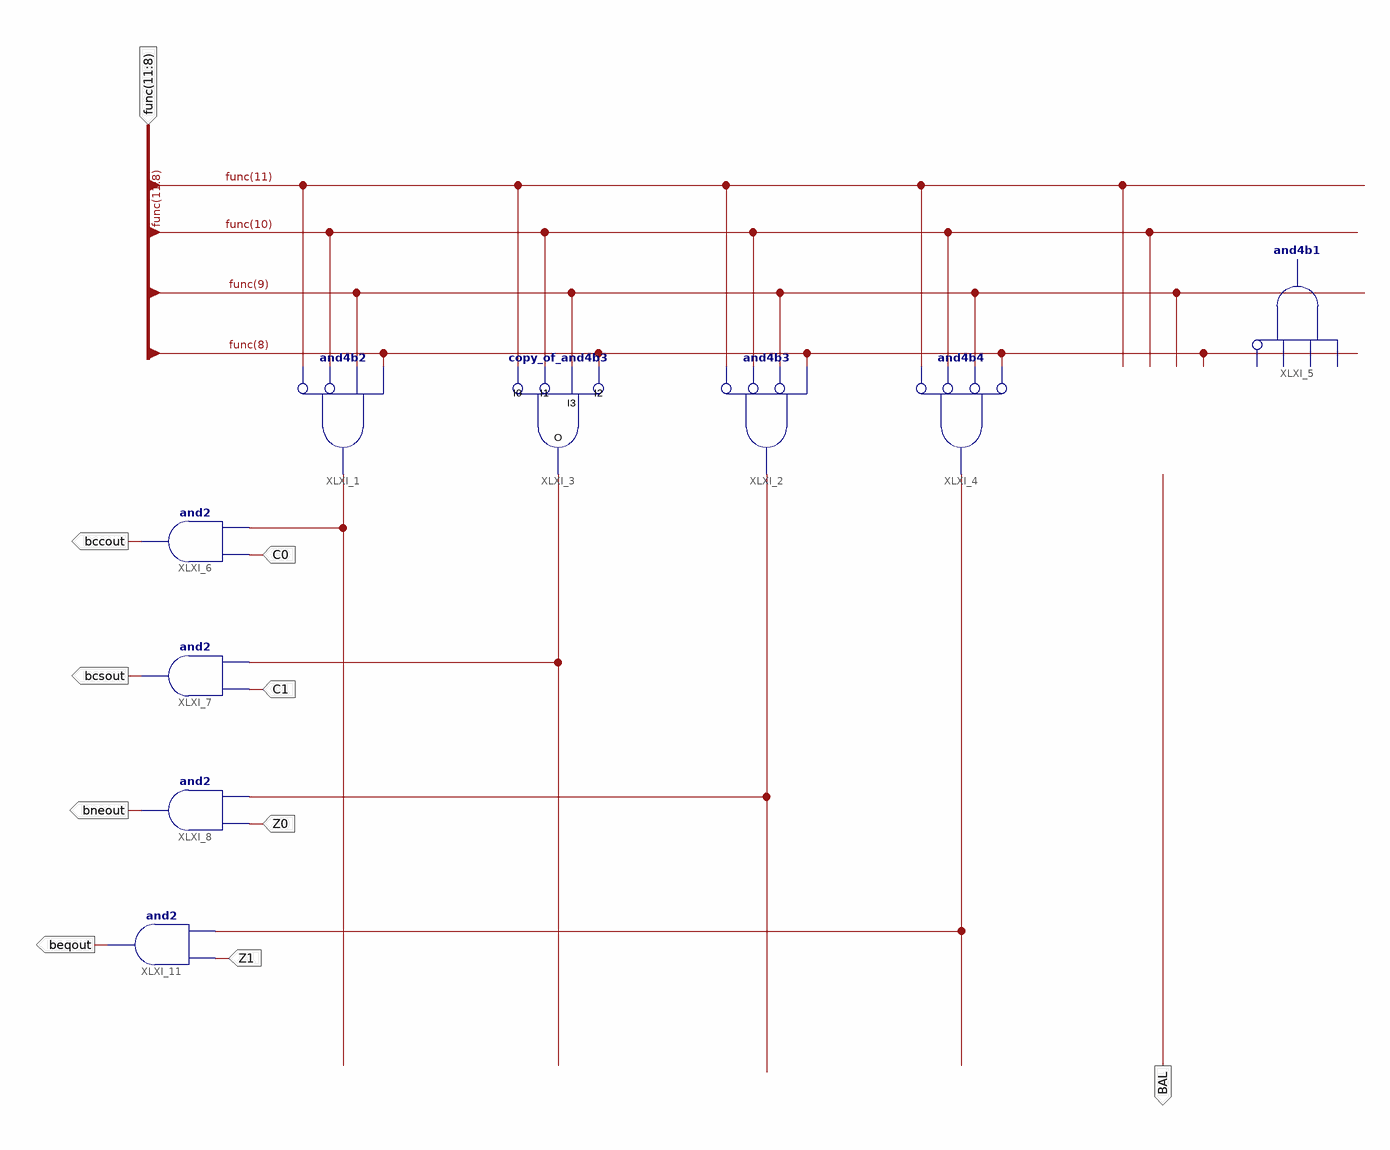
[diagram p0: schematic sheet 1]
// Xilinx ISE schematic Branchdetech.sch (spartan3e) as structural Verilog: 9 symbols, 10 ports
module Branchdetech (
  input  [11:8] func,
  input  C0,
  input  C1,
  input  Z0,
  input  Z1,
  output BAL,
  output bccout,
  output bcsout,
  output bneout,
  output beqout
);

  wire XLXN_7, XLXN_8, XLXN_9, XLXN_10;

  and XLXI_1 (XLXN_7, ~func[11], ~func[10], func[9], func[8]);  // and4b2
  and XLXI_2 (XLXN_9, ~func[11], ~func[10], ~func[9], func[8]);  // and4b3
  copy_of_and4b3 XLXI_3 (.I0(func[11]), .I1(func[10]), .O(XLXN_8), .I3(func[9]), .I2(func[8]));
  and XLXI_4 (XLXN_10, ~func[11], ~func[10], ~func[9], ~func[8]);  // and4b4
  and XLXI_5 (BAL, ~func[8], func[9], func[10], func[11]);  // and4b1
  and XLXI_6 (bccout, XLXN_7, C0);
  and XLXI_7 (bcsout, XLXN_8, C1);
  and XLXI_8 (bneout, XLXN_9, Z0);
  and XLXI_11 (beqout, XLXN_10, Z1);
endmodule
